# Altium schematic sheet CONTROLLER SECTION.SchDoc
size A4 portrait; Organization: Altium Limited; Address1: L3, 12a Rodborough Rd; Address2: Frenchs Forest; Address3: NSW; Address4: Australia 2086
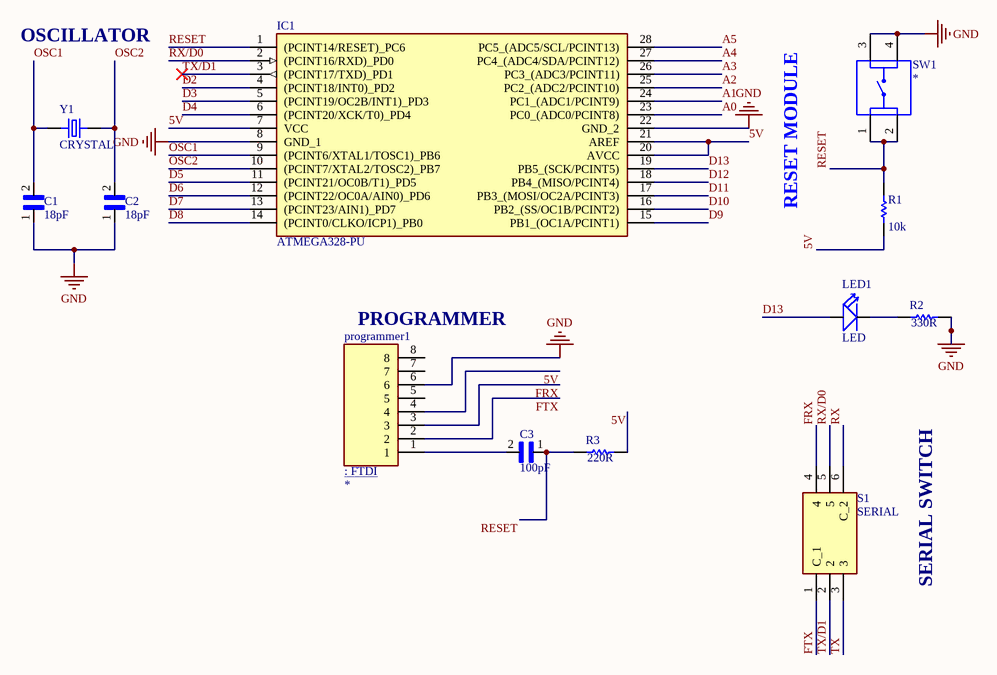
[diagram p0: CONTROLLER SECTION.SchDoc]

## Parts
C1  18pF  [CAP_DE21XSA100KN3AY02F]
C2  18pF  [CAP_DE21XSA100KN3AY02F]
C3  100pF  [CAP_DE21XSA100KN3AY02F]
IC1  ATMEGA328-PU  [DIP1016W53P254L3468H457Q28N]
LED1  LED  [LED2-2.54-D10MM]
programmer1  87247-8  [TE_87247-8]  (value not drawn)
R1  value 10k  [AXIAL-0.5]
R2  value 330R  [AXIAL-0.5]
R3  value 220R  [AXIAL-0.5]
S1  SERIAL  [MPSA22E080150]
SW1  1825910-6  [SW_1825910-6-4]  (value not drawn)
Y1  CRYSTAL  [XTAL_ECS-60-20-4VX]

## Nets
GND: C1.1 C2.1 IC1.8(GND_1) IC1.22(GND_2) programmer1.6 R2.2 SW1.3 SW1.4
5V: IC1.7(VCC) IC1.20(AVCC) IC1.21(AREF) programmer1.4 R1.1 R3.1
A0: IC1.23(PC0_(ADC0/PCINT8))
A1: IC1.24(PC1_(ADC1/PCINT9))
A2: IC1.25(PC2_(ADC2/PCINT10))
A3: IC1.26(PC3_(ADC3/PCINT11))
A4: IC1.27(PC4_(ADC4/SDA/PCINT12))
A5: IC1.28(PC5_(ADC5/SCL/PCINT13))
D2: IC1.4((PCINT18/INT0)_PD2)
D3: IC1.5((PCINT19/OC2B/INT1)_PD3)
D4: IC1.6((PCINT20/XCK/T0)_PD4)
D5: IC1.11((PCINT21/OC0B/T1)_PD5)
D6: IC1.12((PCINT22/OC0A/AIN0)_PD6)
D7: IC1.13((PCINT23/AIN1)_PD7)
D8: IC1.14((PCINT0/CLKO/ICP1)_PB0)
D9: IC1.15(PB1_(OC1A/PCINT1))
D10: IC1.16(PB2_(SS/OC1B/PCINT2))
D11: IC1.17(PB3_(MOSI/OC2A/PCINT3))
D12: IC1.18(PB4_(MISO/PCINT4))
D13: IC1.19(PB5_(SCK/PCINT5)) LED1.POS
FRX: programmer1.3 S1.4
FTX: programmer1.2 S1.1(C_1)
OSC1: C1.2 IC1.9((PCINT6/XTAL1/TOSC1)_PB6) Y1.1
OSC2: C2.2 IC1.10((PCINT7/XTAL2/TOSC2)_PB7) Y1.2
RESET: C3.1 IC1.1((PCINT14/RESET)_PC6) R1.2 R3.2 SW1.1 SW1.2
RX: S1.6(C_2)
RX/D0: IC1.2((PCINT16/RXD)_PD0) S1.5
TX: S1.3
TX/D1: IC1.3((PCINT17/TXD)_PD1) S1.2
NetC3_2: C3.2 programmer1.1
NetLED1_NEG: LED1.NEG R2.1

Not connected (* = marked no-connect by the designer): programmer1 5 7 8

## Notes on the sheet
- OSCILLATOR
- RESET MODULE
- (near programmer1) PROGRAMMER
- SERIAL SWITCH
- Title
- Size:
- Date:
- A4
- Number:
- Time:
- Revision:
- Sheet
- of
- File:
- (in symbol 87247-8) FTDI

## Library data of the parts
C1-C3 = DE21XSA100KN3AY02F: Package: None; Price: None; Value: *; MP: DE21XSA100KN3AY02F; Availability: Unavailable
IC1 = ATMEGA328-PU: Integrated Circuit; Manufacturer_Name: Microchip; Datasheet Link: https://componentsearchengine.com/Datasheets/1/ATMEGA328-PU.pdf; Height: 4.572mm; Manufacturer_Part_Number: ATMEGA328-PU; Arrow Part Number: ATMEGA328-PU; Arrow Price/Stock: https://www.arrow.com/en/products/atmega328-pu/microchip-technology; Mouser Part Number: 556-ATMEGA328-PU; Mouser Price/Stock: https://www.mouser.co.uk/ProductDetail/Microchip-Technology-Atmel/ATMEGA328-PU?qs=lwdSMh1%2FoYJT8tfItQpQtA%3D%3D
LED1 = DIP-LED-GREEN-VAPOROUS-GREEN-10MM(2P-D10MM): DIP LED Green-Vaporous Green-10mm; MF: Chengguangxing; MP: G1004DC; Package: None; Value: *; SnapEDA_Link: https://www.snapeda.com/parts/G1004DC/Chengguangxing/view-part/106403/?ref=snap; Availability: Unavailable; Price: None
programmer1 = 87247-8: Connector Header Through Hole 8 position 0.156 (3.96mm); MF: TE Connectivity; SnapEDA_Link: https://www.snapeda.com/parts/87247-8/TE%20Connectivity%20AMP%20Connectors/view-part/2388036/?ref=snap; EU_RoHS_Compliance: Compliant; Value: *; Availability: Good; Purchase-URL: https://pricing.snapeda.com/search/part/87247-8/?ref=eda; Price: None; MP: 87247-8; Package: None; Comment_1: *
R1-R3 = Res Semi: Semiconductor Resistor; Published: 8-Jun-2000; LatestRevisionDate: 17-Jul-2002; LatestRevisionNote: Re-released for DXP Platform.; PackageReference: AXIAL-0.5; Publisher: Altium Limited; PackageDescription: Axial Device, Thru-Hole; 2 Leads; 0.5 in Pin Spacing
S1 = MPSA-22E08-0150: Switch; Manufacturer_Name: KNITTER-SWITCH; Datasheet Link: http://www.knitter-switch.com/eng/Series/17?search=MPSA-22E08-0150; Height: 8mm; Manufacturer_Part_Number: MPSA-22E08-0150
SW1 = 1825910-6: Switch Push Button OFF _ON_ SPST Round Button 0.05A 24VDC Momentary Contact PC Pins Thru-Hole; Configuration_Pole-Throw: Single Pole - Single Throw; MF: TE Connectivity; Contact_Current_Rating: 50 mA; Digi-Key_Purchase_URL: https://www.digikey.com/product-detail/en/te-connectivity-alcoswitch-switches/1825910-6/450-1650-ND/1632536?utm_source=snapeda&utm_medium=aggregator&utm_campaign=symbol; TE_purchase_URL: https://www.te.com/usa-en/product-1825910-6.html?te_bu=Cor&te_type=disp&te_campaign=seda_glo_cor-seda-global-disp-prtnr-fy19-seda-model-bom-cta_sma-317_1&elqCampaignId=32493; Value: *; Digi-Key_Part_Number: 450-1650-ND; SnapEDA_Link: https://www.snapeda.com/parts/1825910-6/TE%20Connectivity%20ALCOSWITCH%20Switches/view-part/424522/?ref=snap; EU_RoHS_Compliance: Compliant; MP: 1825910-6; Package: None; Comment_1: *
Y1 = ECS-200-20-4VX: 20MHz Â±30ppm Crystal 20pF 40 Ohms HC-49/US; MF: ECS International; SnapEDA_Link: https://www.snapeda.com/parts/ECS-200-20-4VX/ECS%20International/view-part/47294/?ref=snap; Price: None; MP: ECS-200-20-4VX; Value: *; Availability: Unavailable; Package: HC49/US ECS International